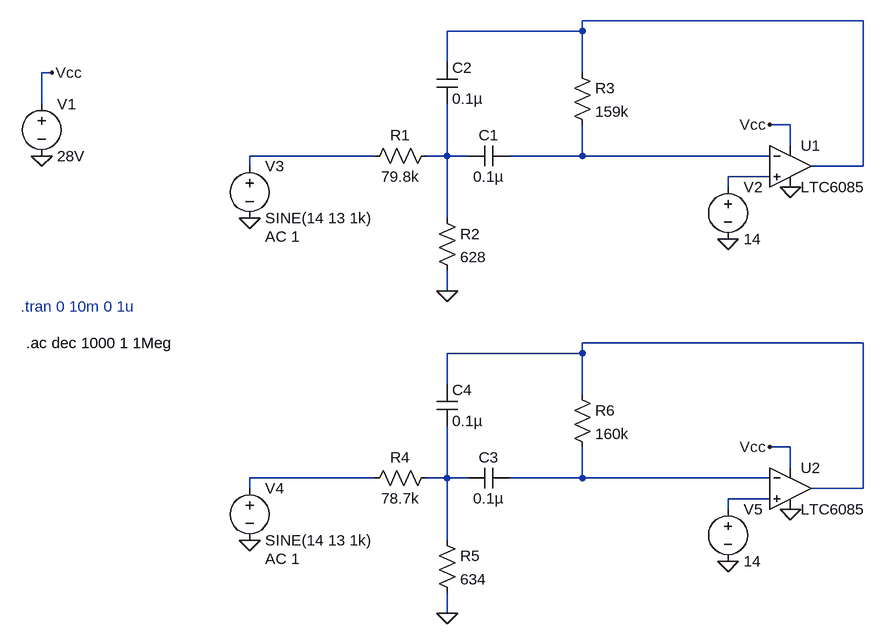
[diagram p0: schematic bp filter resistor value compare.asc]
bp filter resistor value compare.asc, the LTspice schematic file:
Version 4
SHEET 1 1124 996
WIRE 704 -64 272 -64
WIRE 272 -48 272 -64
WIRE 272 -48 64 -48
WIRE 64 0 64 -48
WIRE -544 16 -560 16
WIRE 272 16 272 -48
WIRE -560 64 -560 16
WIRE 592 96 560 96
WIRE 592 128 592 96
WIRE -48 144 -240 144
WIRE 64 144 64 64
WIRE 64 144 32 144
WIRE 96 144 64 144
WIRE 272 144 272 96
WIRE 272 144 160 144
WIRE 560 144 272 144
WIRE -240 160 -240 144
WIRE 704 160 704 -64
WIRE 704 160 624 160
WIRE 560 176 496 176
WIRE 496 192 496 176
WIRE 64 240 64 144
WIRE 64 352 64 320
WIRE 704 432 272 432
WIRE 272 448 272 432
WIRE 272 448 64 448
WIRE 64 496 64 448
WIRE 272 512 272 448
WIRE 592 592 560 592
WIRE 592 624 592 592
WIRE -48 640 -240 640
WIRE 64 640 64 560
WIRE 64 640 32 640
WIRE 96 640 64 640
WIRE 272 640 272 592
WIRE 272 640 160 640
WIRE 560 640 272 640
WIRE -240 656 -240 640
WIRE 704 656 704 432
WIRE 704 656 624 656
WIRE 560 672 496 672
WIRE 496 688 496 672
WIRE 64 736 64 640
WIRE 64 848 64 816
FLAG -560 144 0
FLAG -544 16 Vcc
FLAG -240 240 0
FLAG 592 192 0
FLAG 560 96 Vcc
FLAG 64 352 0
FLAG 496 272 0
FLAG -240 736 0
FLAG 592 688 0
FLAG 560 592 Vcc
FLAG 64 848 0
FLAG 496 768 0
SYMBOL OpAmps\\LTC6085 592 160 R0
SYMATTR InstName U1
SYMBOL voltage -560 48 R0
WINDOW 123 0 0 Left 0
WINDOW 39 0 0 Left 0
SYMATTR InstName V1
SYMATTR Value 28V
SYMBOL voltage -240 144 R0
WINDOW 123 24 124 Left 2
WINDOW 39 0 0 Left 0
SYMATTR InstName V3
SYMATTR Value SINE(14 13 1k)
SYMATTR Value2 AC 1
SYMBOL res 48 128 R90
WINDOW 0 0 56 VBottom 2
WINDOW 3 32 56 VTop 2
SYMATTR InstName R1
SYMATTR Value 79.8k
SYMBOL res 48 224 R0
SYMATTR InstName R2
SYMATTR Value 628
SYMBOL res 256 0 R0
SYMATTR InstName R3
SYMATTR Value 159k
SYMBOL cap 160 128 R90
WINDOW 0 0 32 VBottom 2
WINDOW 3 32 32 VTop 2
SYMATTR InstName C1
SYMATTR Value 0.1µ
SYMBOL cap 48 0 R0
SYMATTR InstName C2
SYMATTR Value 0.1µ
SYMBOL voltage 496 176 R0
WINDOW 123 0 0 Left 0
WINDOW 39 0 0 Left 0
SYMATTR InstName V2
SYMATTR Value 14
SYMBOL OpAmps\\LTC6085 592 656 R0
SYMATTR InstName U2
SYMBOL voltage -240 640 R0
WINDOW 123 24 124 Left 2
WINDOW 39 0 0 Left 0
SYMATTR InstName V4
SYMATTR Value SINE(14 13 1k)
SYMATTR Value2 AC 1
SYMBOL res 48 624 R90
WINDOW 0 0 56 VBottom 2
WINDOW 3 32 56 VTop 2
SYMATTR InstName R4
SYMATTR Value 78.7k
SYMATTR SpiceLine tol=1
SYMBOL res 48 720 R0
SYMATTR InstName R5
SYMATTR Value 634
SYMATTR SpiceLine tol=1
SYMBOL res 256 496 R0
SYMATTR InstName R6
SYMATTR Value 160k
SYMATTR SpiceLine tol=1
SYMBOL cap 160 624 R90
WINDOW 0 0 32 VBottom 2
WINDOW 3 32 32 VTop 2
SYMATTR InstName C3
SYMATTR Value 0.1µ
SYMBOL cap 48 496 R0
SYMATTR InstName C4
SYMATTR Value 0.1µ
SYMBOL voltage 496 672 R0
WINDOW 123 0 0 Left 0
WINDOW 39 0 0 Left 0
SYMATTR InstName V5
SYMATTR Value 14
TEXT -592 376 Left 2 ;.tran 0 10m 0 1u
TEXT -584 432 Left 2 !.ac dec 1000 1 1Meg

The netlist it stands for:
* bp filter resistor value compare.asc
* U1: LTC6085 (symbol OpAmps\LTC6085 not available, pins judged from their places): In+=N005 In-=N004 V+=Vcc V-=0 OUT=N001
V1 Vcc 0 28V
V3 N002 0 SINE(14 13 1k) AC 1
R1 N003 N002 79.8k
R2 N003 0 628
R3 N001 N004 159k
C1 N004 N003 0.1µ
C2 N001 N003 0.1µ
V2 N005 0 14
* U2: LTC6085 (symbol OpAmps\LTC6085 not available, pins judged from their places): In+=N010 In-=N009 V+=Vcc V-=0 OUT=N006
V4 N007 0 SINE(14 13 1k) AC 1
R4 N008 N007 78.7k tol=1
R5 N008 0 634 tol=1
R6 N006 N009 160k tol=1
C3 N009 N008 0.1µ
C4 N006 N008 0.1µ
V5 N010 0 14
* .tran 0 10m 0 1u
.ac dec 1000 1 1Meg
.backanno
.end